# EasyEDA Pro project 乐扣的enginneeee.epro

# Schematic SCARAMOUCHE
Create Date: 2023-09-14; Page Name: P1; Project Name: testing; Schematic Name: SCARAMOUCHE; Update Date: 2023-09-27; Company: 嘉立创EDA; Drawed: MIKUMA; Page Size: A4; Reviewed: ZUIKAKU; Version: V1.0
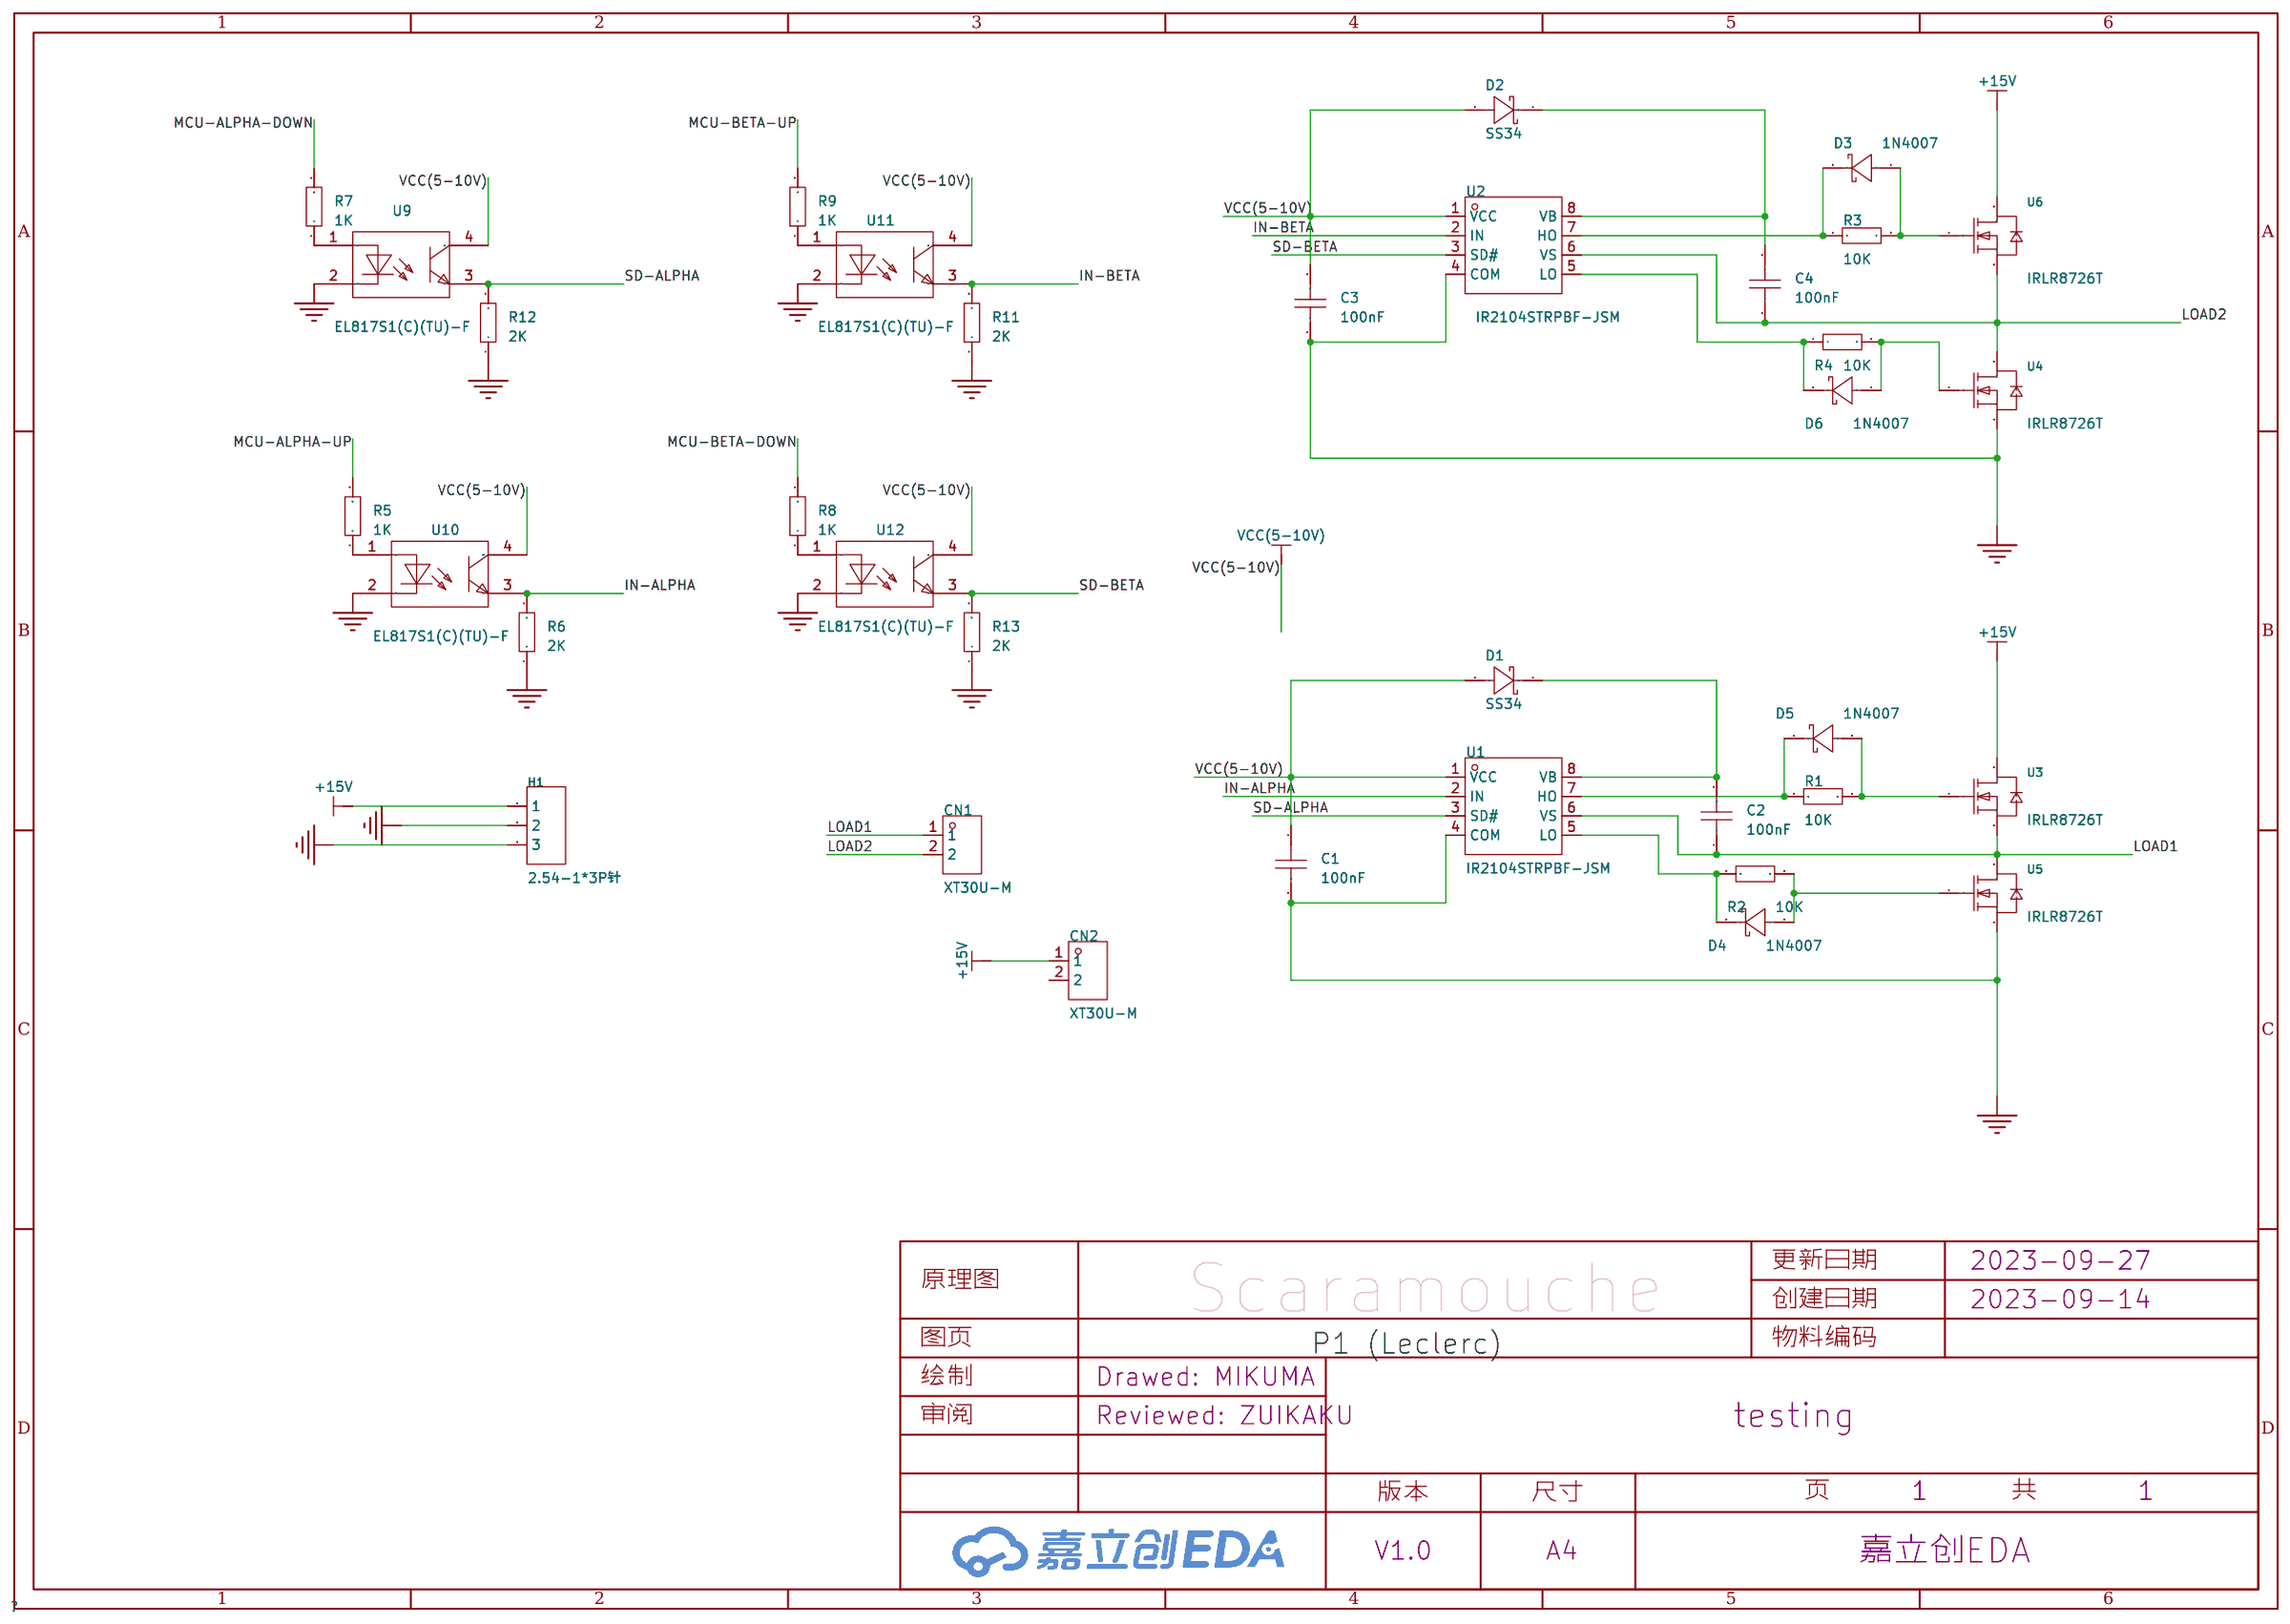
[diagram p0: schematic sheet]

## Parts
C1  100nF  [C0603]
C2  100nF  [C0603]
C3  100nF  [C0603]
C4  100nF  [C0603]
CN1  XT30U-M  [CONN-TH_XT30U-M]
CN2  XT30U-M  [CONN-TH_XT30U-M]
D1  SS34  [SMA_L4.3-W2.5-LS5.0-RD]
D2  SS34  [SMA_L4.3-W2.5-LS5.0-RD]
D3  1N4007  [SMA_L4.3-W2.6-LS5.1-R-RD]
D4  1N4007  [SMA_L4.3-W2.6-LS5.1-R-RD]
D5  1N4007  [SMA_L4.3-W2.6-LS5.1-R-RD]
D6  1N4007  [SMA_L4.3-W2.6-LS5.1-R-RD]
H1  2.54-1*3P针  [HDR-TH_3P-P2.54-V-M-1]
R1  10K  [R0603]
R2  10K  [R0603]
R3  10K  [R0603]
R4  10K  [R0603]
R5  1K  [R0603]
R6  2K  [R0603]
R7  1K  [R0603]
R8  1K  [R0603]
R9  1K  [R0603]
R11  2K  [R0603]
R12  2K  [R0603]
R13  2K  [R0603]
U1  IR2104STRPBF-JSM  [SOIC-8_L4.9-W3.9-P1.27-LS6.0-BL]
U2  IR2104STRPBF-JSM  [SOIC-8_L4.9-W3.9-P1.27-LS6.0-BL]
U3  IRLR8726T  [TO-252-3_L6.5-W5.8-P4.60-LS9.9-BR]
U4  IRLR8726T  [TO-252-3_L6.5-W5.8-P4.60-LS9.9-BR]
U5  IRLR8726T  [TO-252-3_L6.5-W5.8-P4.60-LS9.9-BR]
U6  IRLR8726T  [TO-252-3_L6.5-W5.8-P4.60-LS9.9-BR]
U9  EL817S1(C)(TU)-F  [OPTO-SMD-4_L4.6-W6.5-P2.54-LS10.3-TL]
U10  EL817S1(C)(TU)-F  [OPTO-SMD-4_L4.6-W6.5-P2.54-LS10.3-TL]
U11  EL817S1(C)(TU)-F  [OPTO-SMD-4_L4.6-W6.5-P2.54-LS10.3-TL]
U12  EL817S1(C)(TU)-F  [OPTO-SMD-4_L4.6-W6.5-P2.54-LS10.3-TL]

## Library data of the parts
C1-C4 = CAP_0603: Supplier Footprint: 0603
CN1 CN2 = XT30U-M: 模型插头轻量版锂电池插头; LCSC Part Name: AMASS(艾迈斯)轻量版锂电池插头公头 XT30U-M; Supplier Part: C99101; Manufacturer: AMASS(艾迈斯); JLCPCB Part Class: Extended Part; Datasheet: https://atta.szlcsc.com/upload/public/pdf/source/20170606/1496716542582.pdf; Supplier: LCSC
D1 D2 = SS34_C727060: 二极管配置:独立式;直流反向耐压(Vr):40V;平均整流电流(Io):3A;正向压降(Vf):550mV@3A;; LCSC Part Name: 40V 3A 550mV@3A; Supplier Part: C727060; Manufacturer: TWGMC(台湾迪嘉); Supplier Footprint: SMA; JLCPCB Part Class: Extended Part; Datasheet: https://atta.szlcsc.com/upload/public/pdf/source/20200828/C727059_6599B6CAC5F3238B9C33E46794659DBE.pdf; Supplier: LCSC; Diode Configuration: 独立式; Reverse Voltage (Vr): 40V; Average Rectified Current (Io): 3A; Forward Voltage (Vf@If): 550mV@3A; Reverse Leakage Current (Ir): 500uA@40V
D3-D6 = 1N4007_C2892673: 二极管配置:-;直流反向耐压(Vr):1kV;平均整流电流(Io):1A;正向压降(Vf):1.1V@1A;反向电流(Ir):5uA@1kV;; LCSC Part Name: 1kV 1A 1.1V@1A DO-214AC; Supplier Part: C2892673; Manufacturer: YONGYUTAI(永裕泰); Supplier Footprint: SMA(DO-214AC); JLCPCB Part Class: 扩展库; Datasheet: https://atta.szlcsc.com/upload/public/pdf/source/20210906/4E1432E8E624C96A2E9E3CA0932F1666.pdf; Supplier: LCSC; Reverse Voltage (Vr): 1kV; Average Rectified Current (Io): 1A; Forward Voltage (Vf@If): 1.1V@1A; Reverse Leakage Current: 5uA@1kV
H1 = 2.54-1*3P针: 排数:单排;总PIN位数:3;间距:2.54mm;插针结构:1x3P;行距:-;安装类型:直插;圆针/方针:方针;额定电流:3A;额定电压:-;配合针长度:-;塑高:-;端接针长度:-;触头材质:-;触头镀层:-;工作温度范围:-40℃~+105℃;颜色:黑色;; LCSC Part Name: 2.54mm 1x3P 直插 方针; Supplier Part: C49257; Manufacturer: BOOMELE(博穆精密); Supplier Footprint: 直插,P=2.54mm; JLCPCB Part Class: 扩展库; Supplier: LCSC; Number of Rows: 单排; Number of Pins: 3; Pitch: 2.54mm; Pin Structure: 1x3P; Mounting Type: 直插; Circluar Pins/Square Pins: 方针; Current Rating (Max): 3A; Operating Temperature Range: -40℃~+105℃; Color: 黑色
R1-R9 R11-R13 = Res_0603: Supplier Footprint: 0603
U1 U2 = IR2104STRPBF-JSM: 700V单相驱动带SD功能高压、高速功率高低侧驱动芯片 驱动配置：高低侧 负载类型：MOSFET；IGBT 含自举二极管 电源电压：10V~20V 峰值灌电流：0.6A 峰值拉电流：0.3A 带上下电保护、欠压保护。; LCSC Part Name: IR2104STR; Supplier Part: C5804631; Manufacturer: JSMSEMI(杰盛微); Supplier Footprint: SOP-8; Datasheet: https://atta.szlcsc.com/upload/public/pdf/source/20230727/38AFF22131FFAF4BAA2F78EEBC87DB5C.pdf; Supplier: LCSC
U3-U6 = IRLR8726T: 类型:N沟道;漏源电压(Vdss):30V;连续漏极电流(Id):80A;功率(Pd):54W;导通电阻(RDS(on)@Vgs,Id):6mΩ@10V;; LCSC Part Name: N沟道 耐压:30V 电流:80A; Supplier Part: C5261061; Manufacturer: HXY MOSFET(华轩阳电子); Supplier Footprint: TO-252; JLCPCB Part Class: 扩展库; Datasheet: https://atta.szlcsc.com/upload/public/pdf/source/20221216/129C4C374DCD55B1043953A9F864A508.pdf; Supplier: LCSC; Type: N沟道; Drain Source Voltage (Vdss): 30V; Continuous Drain Current (Id): 80A; Power Dissipation (Pd): 54W; Drain Source On Resistance (RDS(on)@Vgs,Id): 6mΩ@10V; Gate Threshold Voltage (Vgs(th)@Id): 2.5V@250uA; Input Capacitance (Ciss@Vds): 1.16nF
U9-U12 = EL817S1(C)(TU)-F: 输入电压类型:DC;输出通道数:1;正向电压:1.2V;反向电压:6V;输出电流:50mA;接收端电压:35V;集射极饱和电压(Vce(sat)@Ic,IF):100mV@1mA,20mA;隔离电压(rms):5kV;; LCSC Part Name: DC输入 隔离电压(rms):5000V; Supplier Part: C106900; Manufacturer: EVERLIGHT(亿光); Supplier Footprint: SMD-4P; JLCPCB Part Class: 基础库; Datasheet: https://atta.szlcsc.com/upload/public/pdf/source/20170418/1492506316853.pdf; Supplier: LCSC; Input voltage type: DC; Output Type: 光电三极管; Number of Outputs: 1; Forward Voltage: 1.2V; Reverse Voltage: 6V; Output Current: 50mA; Receiving End Voltage: 35V; Collector-Emitter Saturation Voltage (Vce(sat)@Ic,IF): 100mV@1mA,20mA; Rise time: 18us@2mA,100Ω; Fall time: 18us@2mA,100Ω; Isolation Voltage(rms): 5kV; Operating Temperature: -55℃~+110℃

## Nets
+15V: CN2.1 H1.1 U3.2(D) U6.2(D)
GND: C1.2 C3.1 H1.2 R6.1 R11.1 R12.1 R13.1 U1.4(COM) U2.4(COM) U4.3(S) U5.3(S)
GND1: H1.3 U9.2(CAT) U10.2(CAT) U11.2(CAT) U12.2(CAT)
VCC(5-10V): C1.1 C3.2 D1.2(A) D2.2(A) U1.1(VCC) U2.1(VCC) U9.4(COL) U10.4(COL) U11.4(COL) U12.4(COL)
IN-ALPHA: R6.2 U1.2(IN) U10.3(EM)
IN-BETA: R11.2 U2.2(IN) U11.3(EM)
LOAD1: C2.1 CN1.1 U1.6(VS) U3.3(S) U5.2(D)
LOAD2: C4.1 CN1.2 U2.6(VS) U4.2(D) U6.3(S)
MCU-ALPHA-DOWN: R7.2
MCU-ALPHA-UP: R5.2
MCU-BETA-DOWN: R8.2
MCU-BETA-UP: R9.2
SD-ALPHA: R12.2 U1.3(SD#) U9.3(EM)
SD-BETA: R13.2 U2.3(SD#) U12.3(EM)
$1N916: C2.2 D1.1(C) U1.8(VB)
$1N2715: C4.2 D2.1(C) U2.8(VB)
$1N3428: D5.2(K) R1.1 U1.7(HO)
$1N3432: D5.1(A) R1.2 U3.1(G)
$1N3448: D4.1(A) R2.2 U5.1(G)
$1N3456: D4.2(K) R2.1 U1.5(LO)
$1N3462: D3.2(K) R3.1 U2.7(HO)
$1N3475: D3.1(A) R3.2 U6.1(G)
$1N3484: D6.2(K) R4.1 U2.5(LO)
$1N3490: D6.1(A) R4.2 U4.1(G)
Net-(R5-1): R5.1 U10.1(AN)
Net-(R7-1): R7.1 U9.1(AN)
Net-(R8-1): R8.1 U12.1(AN)
Net-(R9-1): R9.1 U11.1(AN)

Not connected (* = marked no-connect by the designer): CN2 2

## Notes on the sheet
- Scaramouche
- P1 (Leclerc)

# Board PCB1
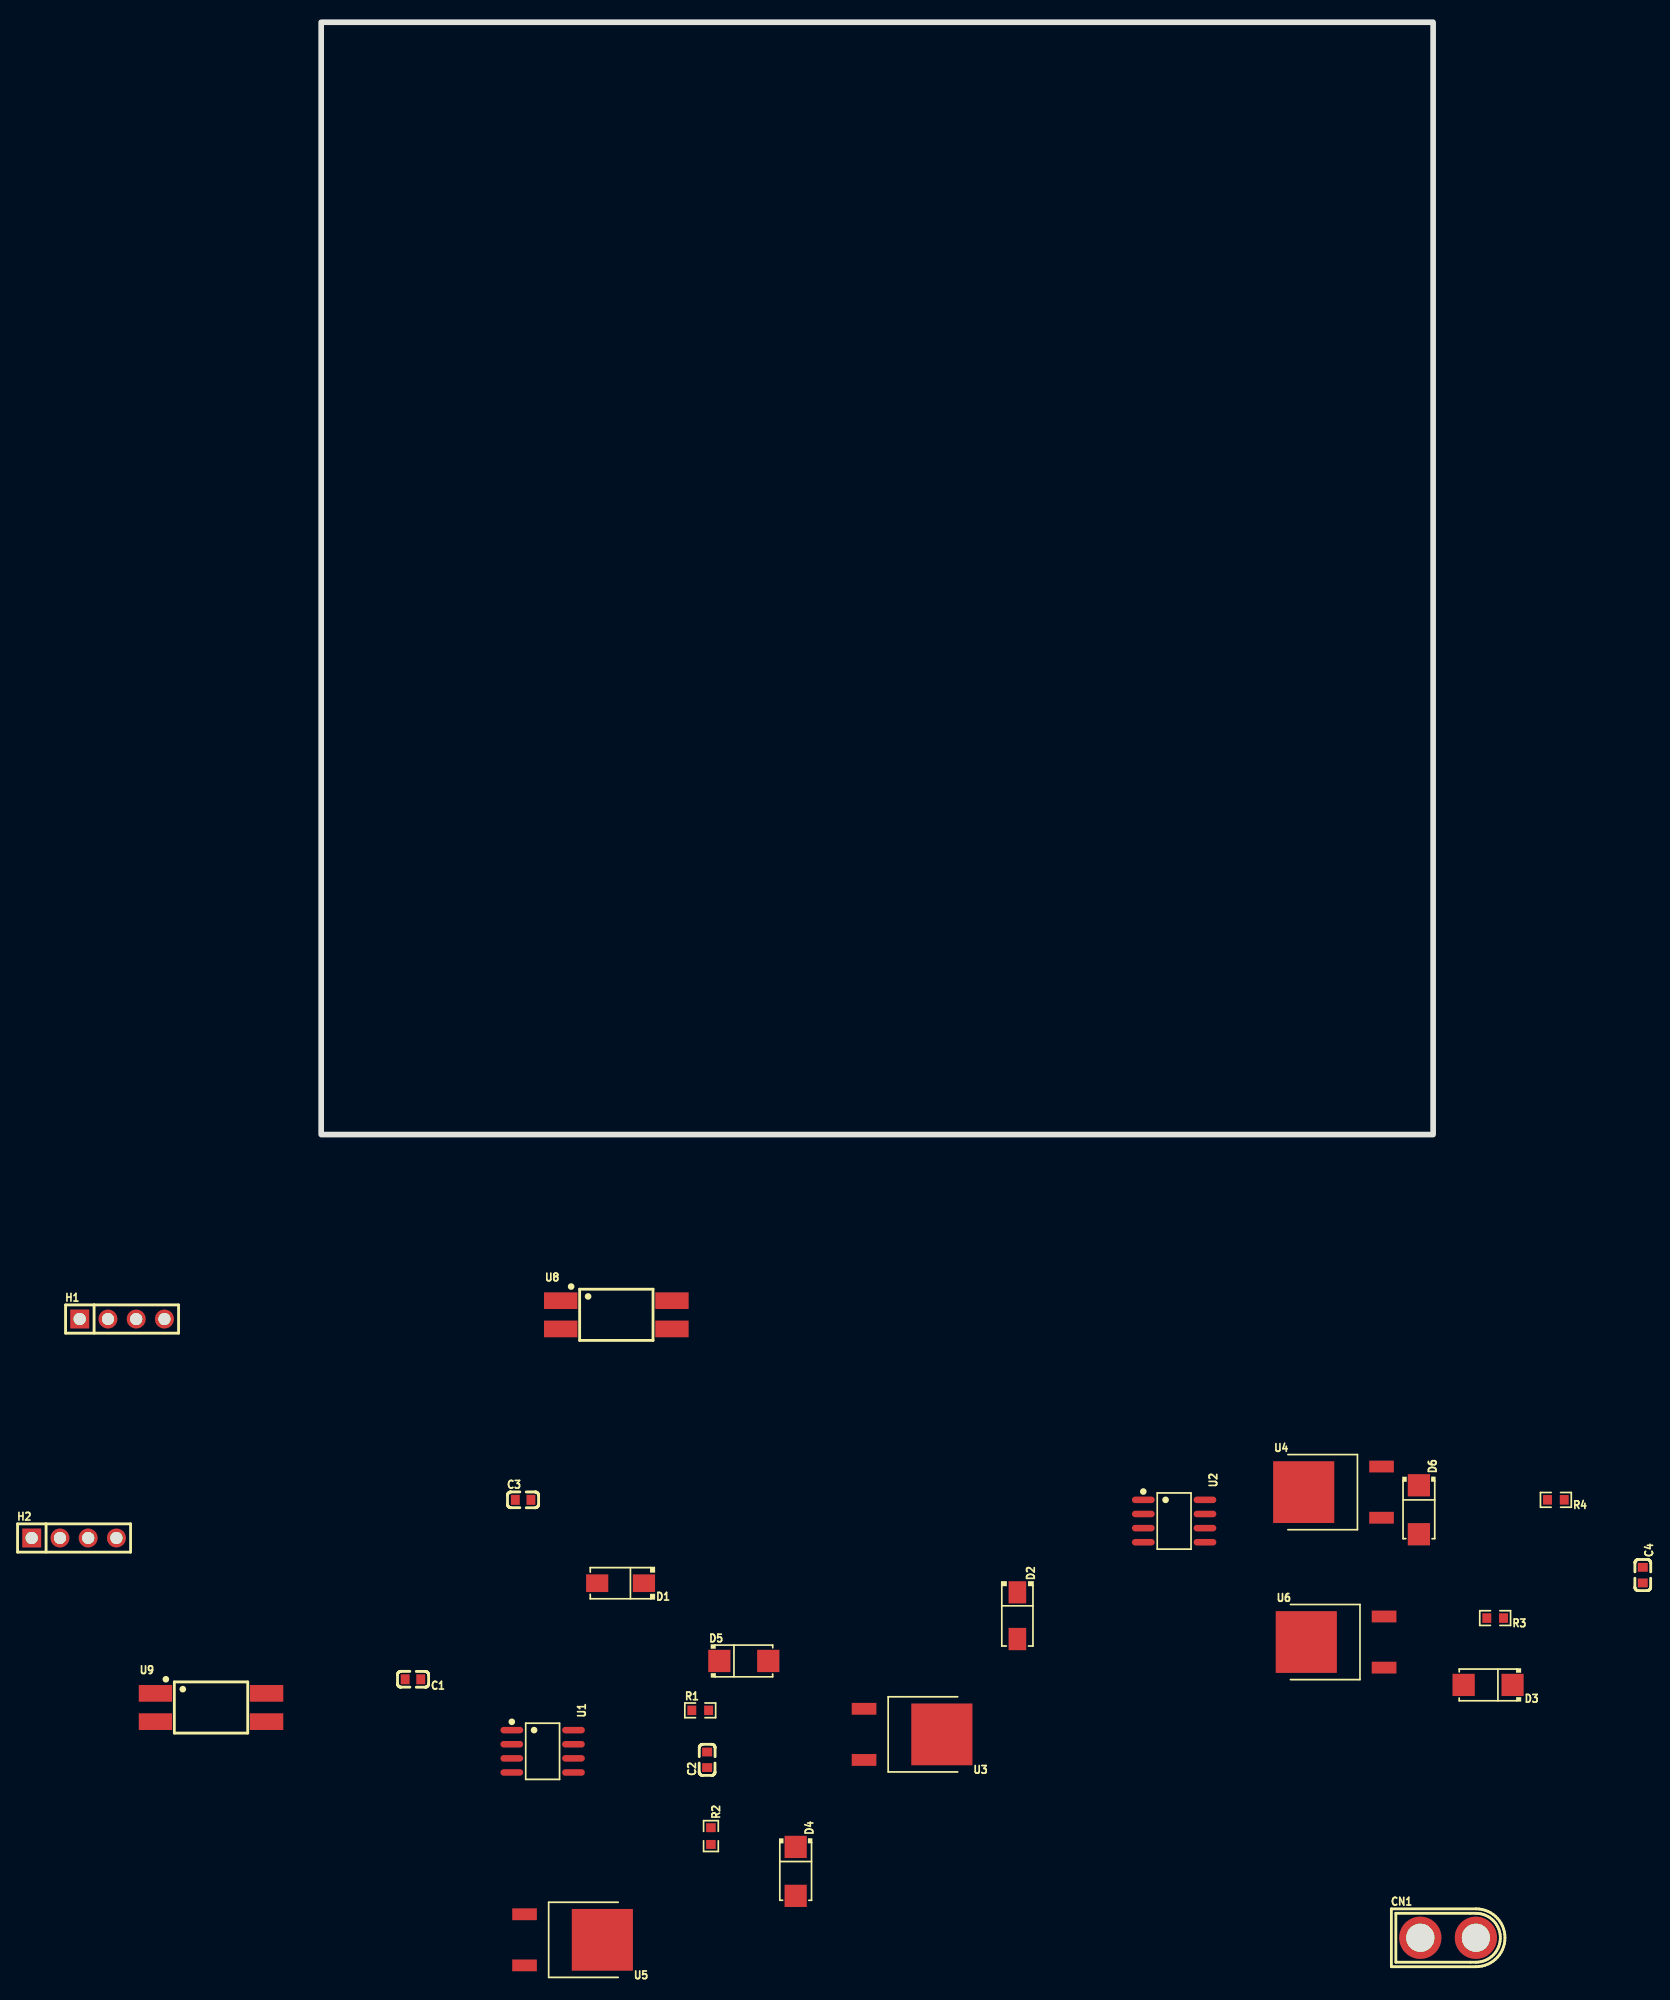
[diagram p1: board, top side]
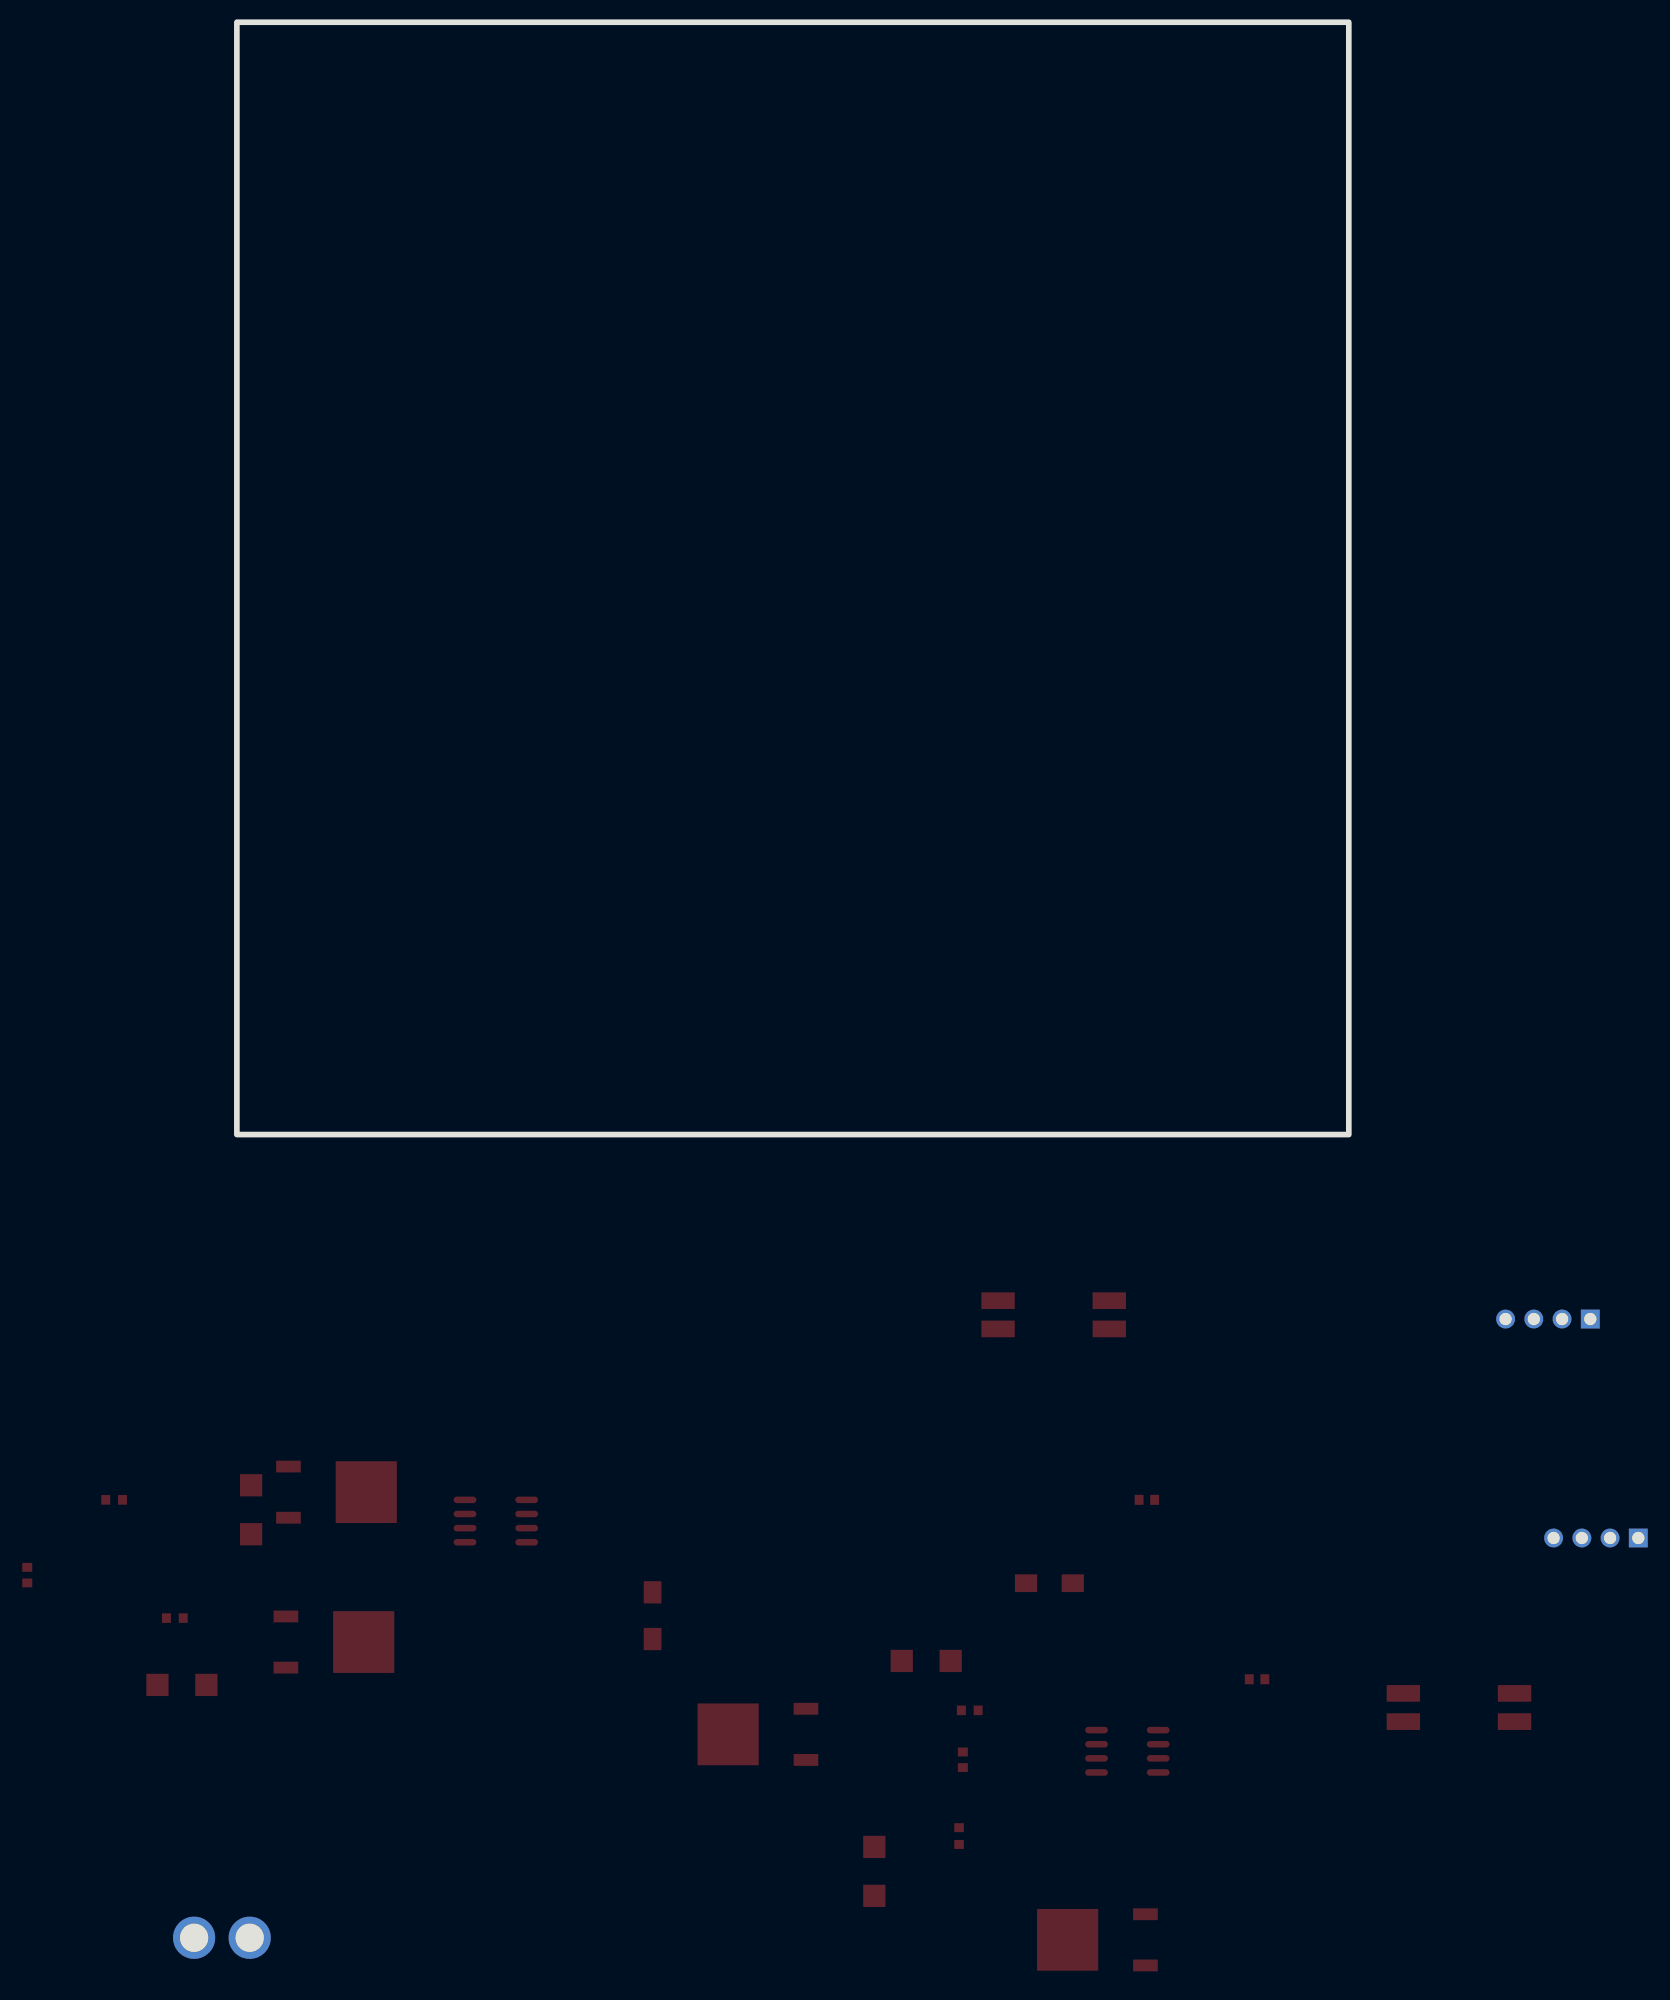
[diagram p2: board, bottom side, seen from below]

Outline 100 x 100 mm; copper layers: Top Layer, Bottom Layer. Coordinates in mm from the lower left corner of the outline.
Outline path: rectangle 0,100 100,0
Stack: Top Layer 0.035mm / Dielectric1 1.51mm FR4 er 4.5 / Bottom Layer 0.035mm

## Design rules (mm)
template: JLCPCB Capability(Two Layers Board)
spacing copperThickness1oz (default): track to track 0.102, other pairs 0.152 to 0.3
spacing copperThickness2oz: track to track 0.203, other pairs 0.152 to 0.3
track width copperThickness1oz (default): min 0.127, default 0.254, max 2.54
track width copperThickness2oz: min 0.203, default 0.254, max 2.54
differential pair differentialPair (default): width min 0.127, default 0.254, max 2.54; gap min 0.152, default 0.152
via viaSize (default): diameter min 0.5, default 0.61, max 10; hole min 0.3, default 0.305, max 6.3

## Placement (name value [footprint] x y rotation side)
C1  100nF  [C0603]  8.26 -48.97 180 top
C2  100nF  [C0603]  34.71 -56.21 90 top
C3  100nF  [C0603]  18.16 -32.84 0 top
C4  100nF  [C0603]  118.85 -39.61 270 top
CN1  XT30U-M  [CONN-TH_XT30U-M]  101.35 -72.21 0 top
D1  SS34  [SMA_L4.3-W2.5-LS5.0-RD]  26.92 -40.33 180 top
D2  SS34  [SMA_L4.3-W2.5-LS5.0-RD]  62.61 -43.26 270 top
D3  1N4007  [SMA_L4.3-W2.6-LS5.1-R-RD]  104.94 -49.48 180 top
D4  1N4007  [SMA_L4.3-W2.6-LS5.1-R-RD]  42.67 -66.24 270 top
D5  1N4007  [SMA_L4.3-W2.6-LS5.1-R-RD]  38.01 -47.33 0 top
D6  1N4007  [SMA_L4.3-W2.6-LS5.1-R-RD]  98.72 -33.73 270 top
H1  2.54-1*3P针  [HDR-TH_4P-P2.54-V-M]  -17.91 -16.59 0 top
H2  PZ254V-11-04P  [HDR-TH_4P-P2.54-V-M]  -22.22 -36.27 0 top
R1  10K  [R0603]  34.09 -51.76 0 top
R2  10K  [R0603]  35.05 -63.07 270 top
R3  10K  [R0603]  105.58 -43.47 180 top
R4  10K  [R0603]  111.04 -32.84 180 top
U1  IR2104STRPBF-JSM  [SOIC-8_L4.9-W3.9-P1.27-LS6.0-BL]  19.92 -55.45 270 top
U2  IR2104STRPBF-JSM  [SOIC-8_L4.9-W3.9-P1.27-LS6.0-BL]  76.71 -34.75 270 top
U3  IRLR8726T  [TO-252-3_L6.5-W5.8-P4.60-LS9.9-BR]  52.32 -53.93 180 top
U4  IRLR8726T  [TO-252-3_L6.5-W5.8-P4.60-LS9.9-BR]  91.86 -32.15 0 top
U5  IRLR8726T  [TO-252-3_L6.5-W5.8-P4.60-LS9.9-BR]  21.79 -72.4 180 top
U6  IRLR8726T  [TO-252-3_L6.5-W5.8-P4.60-LS9.9-BR]  92.09 -45.63 0 top
U8  EL817S1(C)(TU)-F  [OPTO-SMD-4_L4.6-W6.5-P2.54-LS10.3-TL]  26.54 -16.2 0 top
U9  EL817S1(C)(TU)-F  [OPTO-SMD-4_L4.6-W6.5-P2.54-LS10.3-TL]  -9.91 -51.51 0 top

## Footprints (pads in the part's own frame, mm; a bottom-side part is the same pattern mirrored in y, then rotated)
C0603
  rect 0.8x0.9 smd: 1(-0.7,0) 2(0.7,0)
CONN-TH_XT30U-M
  round 3.8 hole 2.54: 1(-2.5,0) 2(2.5,0)
HDR-TH_4P-P2.54-V-M
  rect 1.7x1.7 hole 1.1: 1(-3.81,0)
  round 1.7 hole 1.1: 2(-1.27,0) 3(1.27,0) 4(3.81,0)
OPTO-SMD-4_L4.6-W6.5-P2.54-LS10.3-TL
  rect 3x1.5 smd: 1(-5,1.27) 2(-5,-1.27) 3(5,-1.27) 4(5,1.27)
R0603
  rect 0.806x0.864 smd: 1(-0.753,0) 2(0.753,0)
SMA_L4.3-W2.5-LS5.0-RD
  rect 2x1.593 smd: 1(-2.1,0) 2(2.1,0)
SMA_L4.3-W2.6-LS5.1-R-RD
  rect 2x2 smd: 1(2.2,0) 2(-2.2,0)
SOIC-8_L4.9-W3.9-P1.27-LS6.0-BL
  oval 0.588x2.045 smd: 1(-1.905,-2.772) 2(-0.635,-2.772) 3(0.635,-2.772) 4(1.905,-2.772) 5(1.905,2.772) 6(0.635,2.772) 7(-0.635,2.772) 8(-1.905,2.772)
TO-252-3_L6.5-W5.8-P4.60-LS9.9-BR
  rect 2.219x1.064 smd: 1(3.498,-2.3) 3(3.498,2.3)
  rect 5.5x5.553 smd: 2(-3.498,0)

## Nets
+15V: U3.2 U6.2
GND: C1.2 C3.1 H1.1 H1.2 H2.1 H2.2 U1.4 U2.4 U4.3 U5.3
VCC(5-10V): C1.1 C3.2 D1.2 D2.2 U1.1 U2.1
IN-ALPHA: U1.2 U9.4
IN-BETA: U2.2 U8.4
LOAD1: C2.1 CN1.1 U1.6 U3.3 U5.2
LOAD2: C4.1 CN1.2 U2.6 U4.2 U6.3
SD-ALPHA: U1.3 U9.3
SD-BETA: U2.3 U8.3
$1N916: C2.2 D1.1 U1.8
$1N2715: C4.2 D2.1 U2.8
$1N3428: D5.2 R1.1 U1.7
$1N3432: D5.1 R1.2 U3.1
$1N3448: D4.1 R2.2 U5.1
$1N3456: D4.2 R2.1 U1.5
$1N3462: D3.2 R3.1 U2.7
$1N3475: D3.1 R3.2 U6.1
$1N3484: D6.2 R4.1 U2.5
$1N3490: D6.1 R4.2 U4.1
$1N6016: H1.4 U8.1
$1N6019: H1.3 U8.2
$1N6063: H2.4 U9.1
$1N6066: H2.3 U9.2
